# EAGLE design daughtercard (EAGLE 9.6.2)
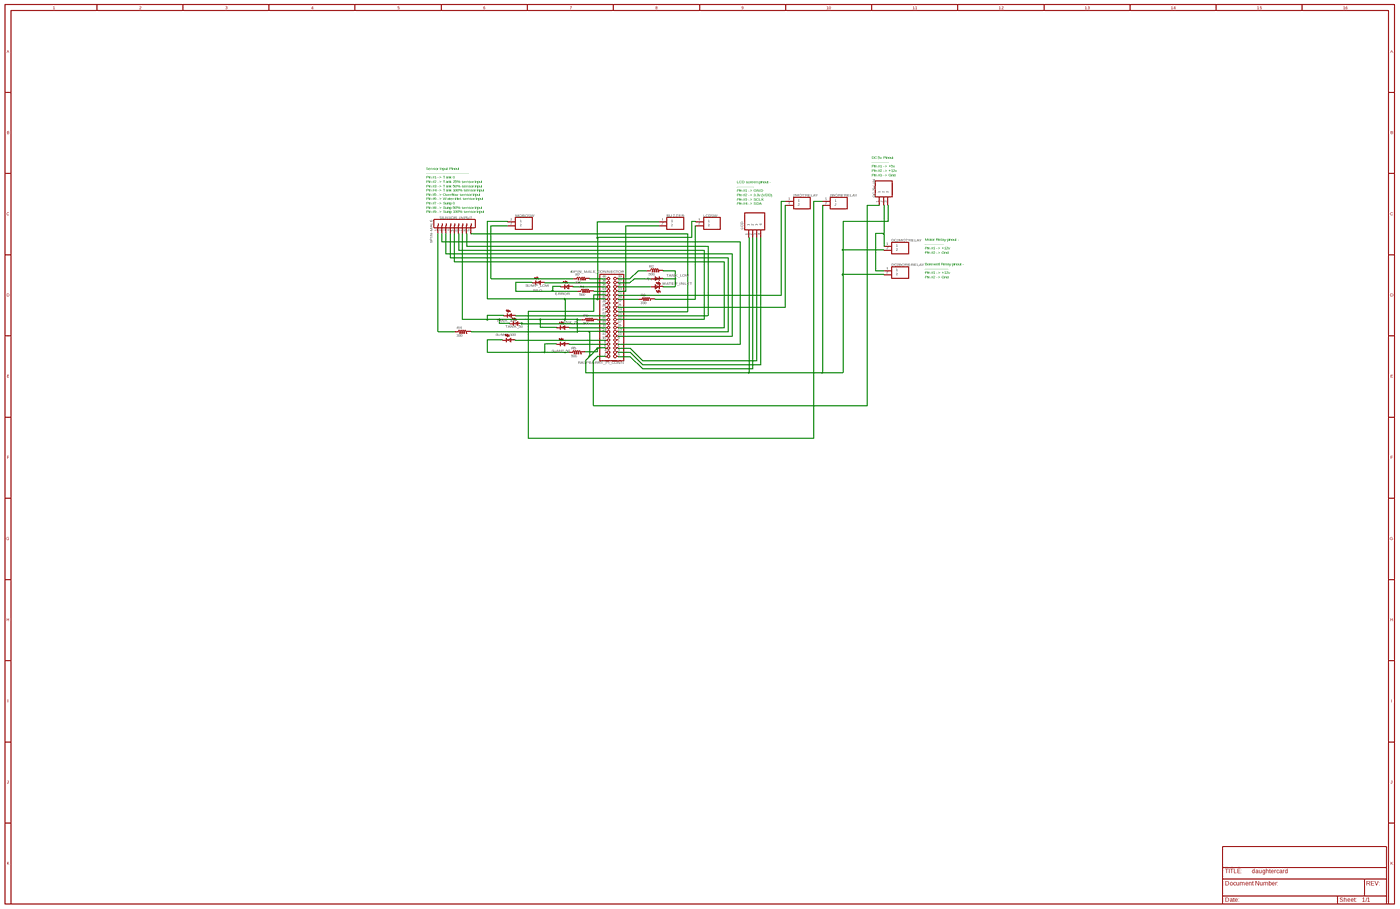
[diagram p0: schematic, sheet 1, overview]
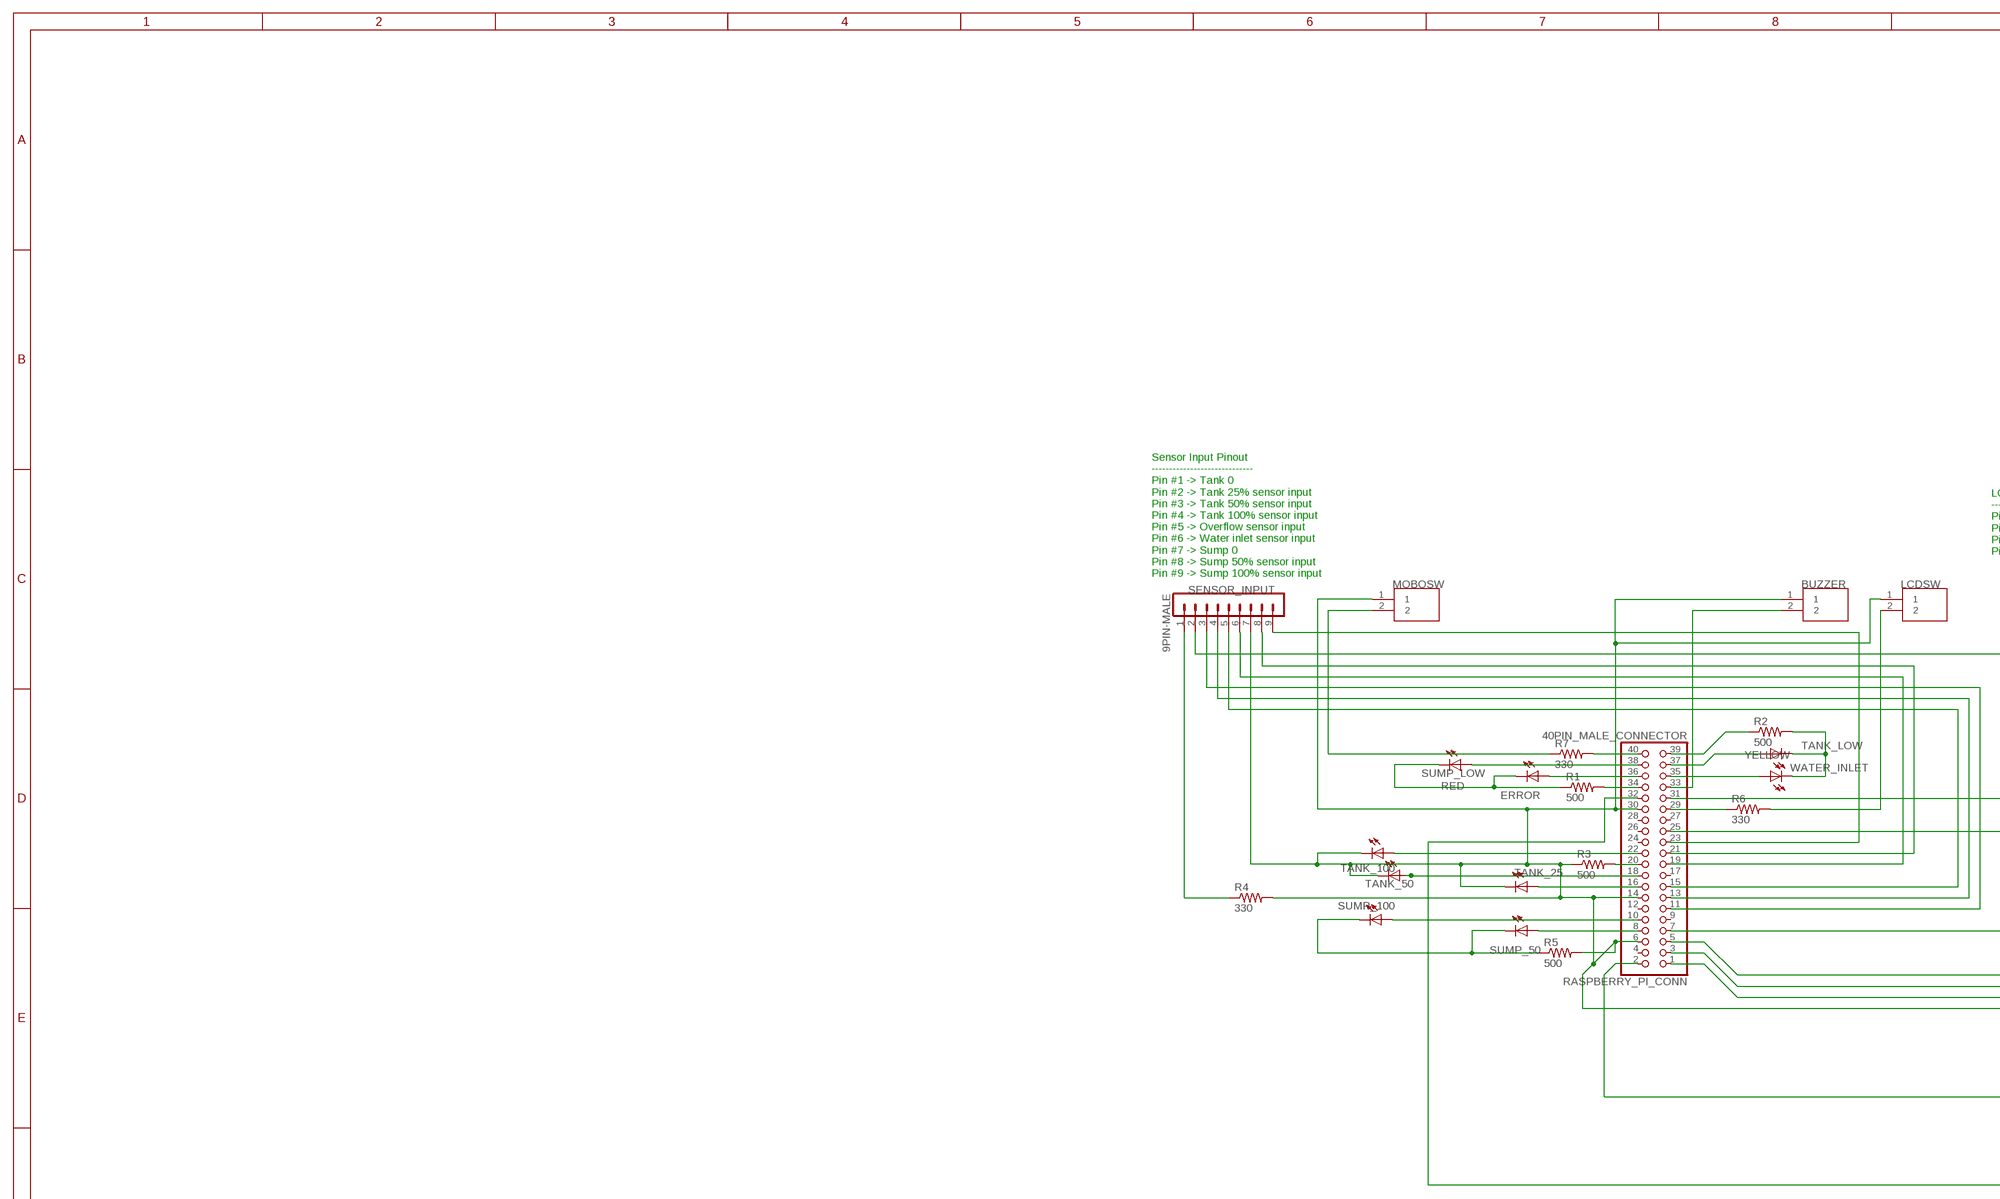
[diagram p1: schematic, sheet 1, part 1 of 4]
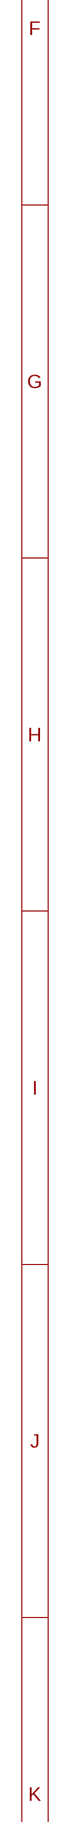
[diagram p2: schematic, sheet 1, part 2 of 4]
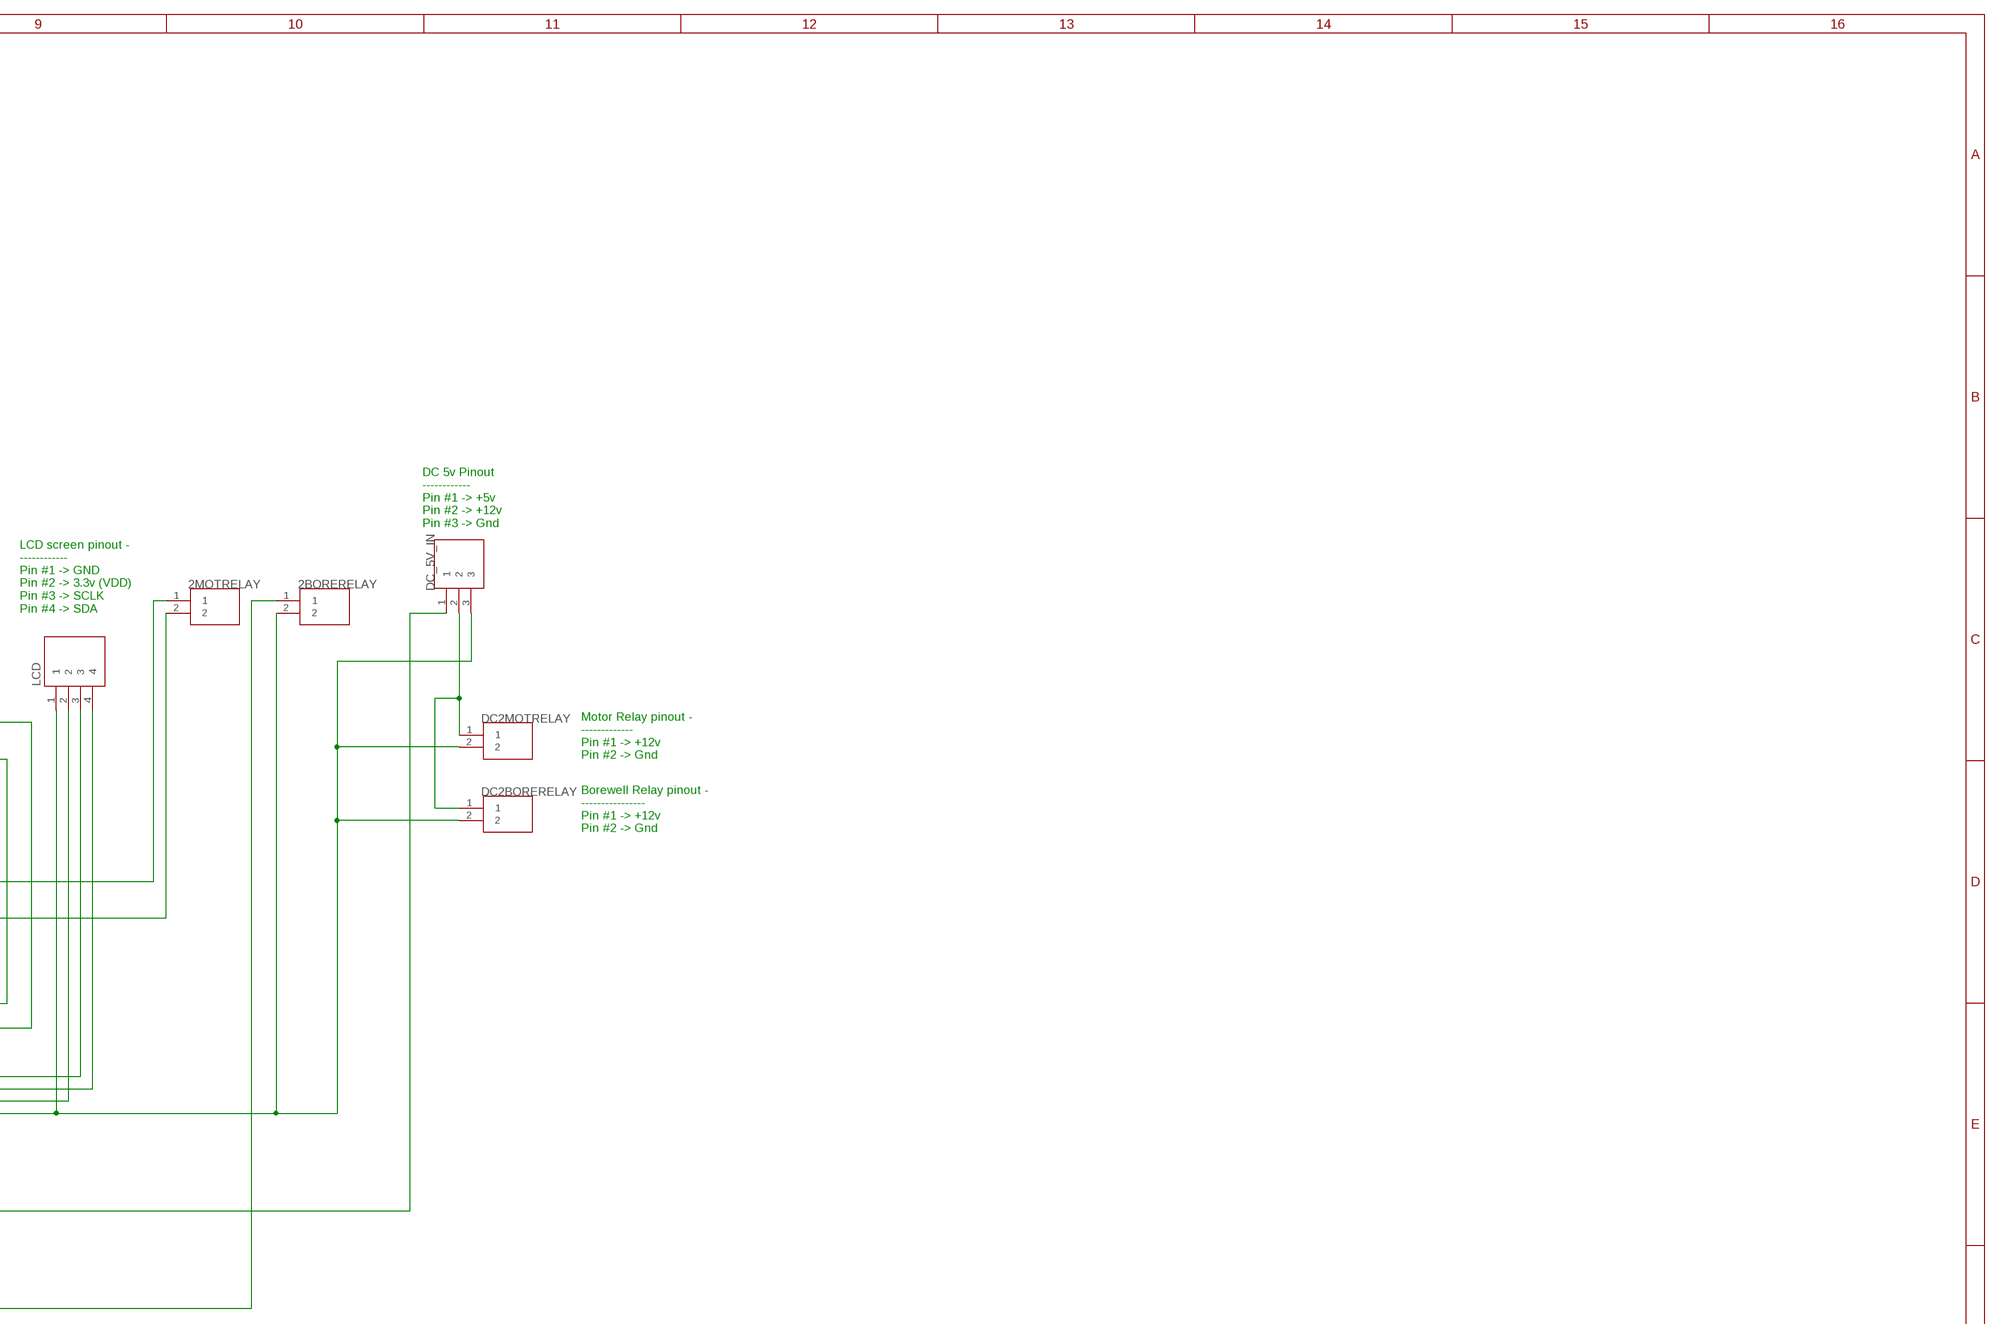
[diagram p3: schematic, sheet 1, part 3 of 4]
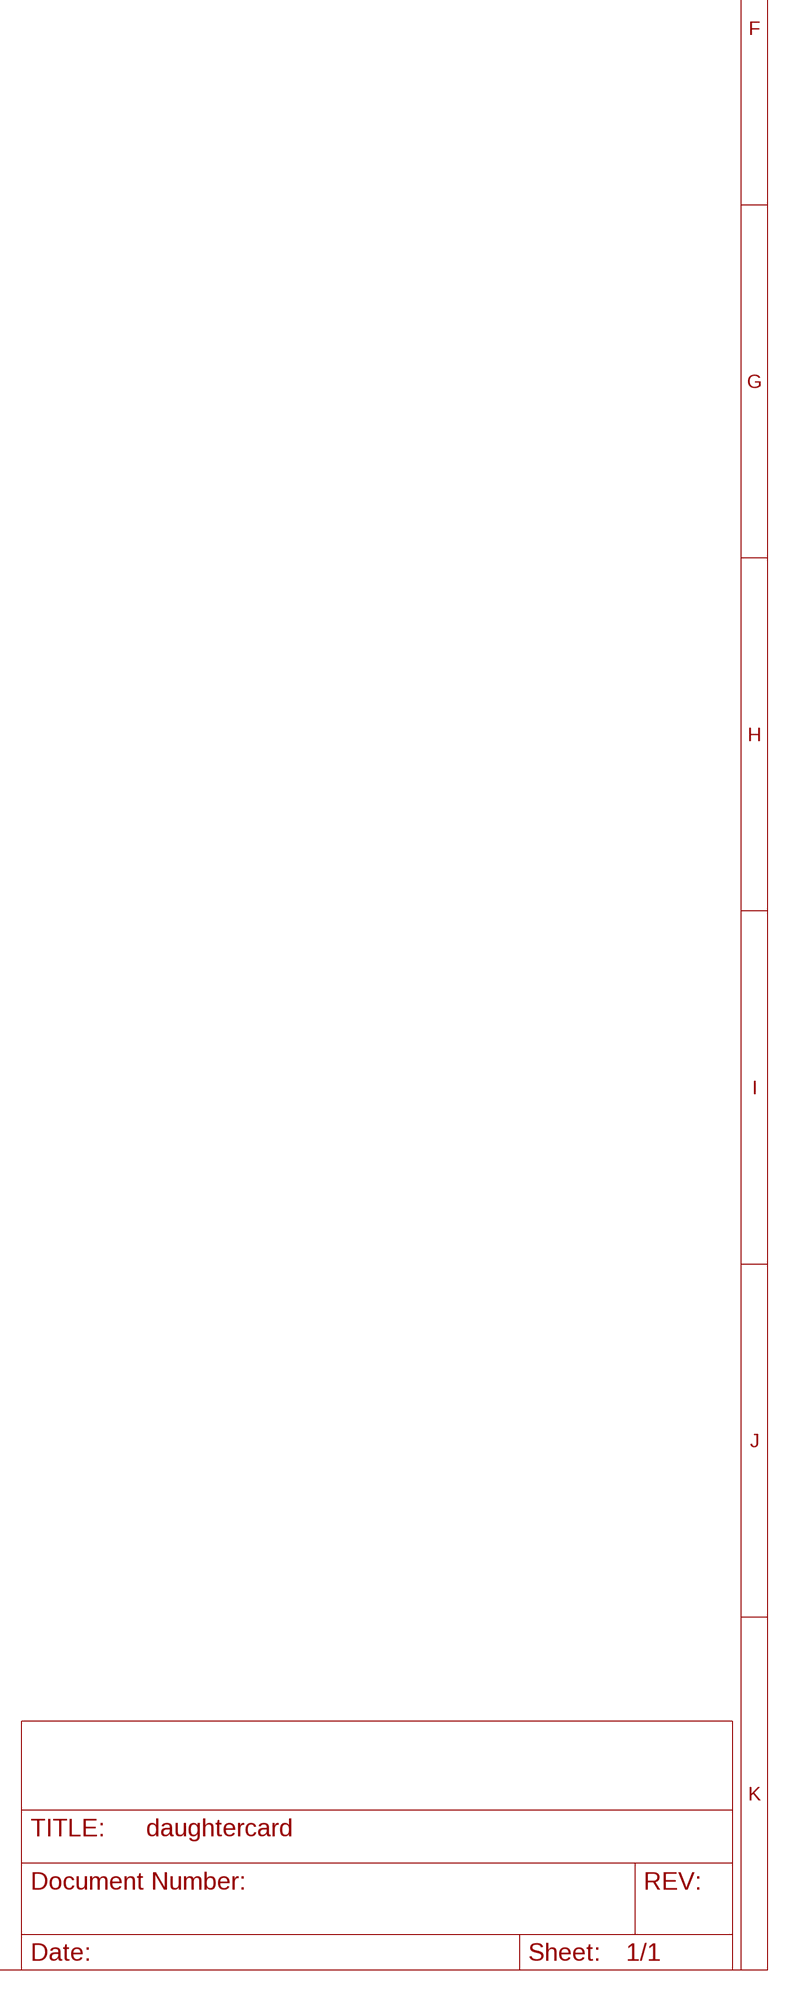
[diagram p4: schematic, sheet 1, part 4 of 4]

## Parts
2BORERELAY  440055-2  [TE_440055-2]
2MOTRELAY  440055-2  [TE_440055-2]
BUZZER  440055-2  [TE_440055-2]
DC2BORERELAY  440055-2  [TE_440055-2]
DC2MOTRELAY  440055-2  [TE_440055-2]
DC_5V_IN  440052-3  [TE_440052-3]
ERROR  RED  LED3MM  [LED3MM]
LCD  110990030  [SEEED_110990030]
LCDSW  440055-2  [TE_440055-2]
MOBOSW  440055-2  [TE_440055-2]
R1  500  R-US_0204/2V  [0204V]
R2  500  R-US_0204/2V  [0204V]
R3  500  R-US_0204/7  [0204/7]
R4  330  R-US_0204/7  [0204/7]
R5  500  R-US_0204/2V  [0204V]
R6  330  R-US_0204/2V  [0204V]
R7  330  R-US_0204/2V  [0204V]
RASPBERRY_PI_CONN  40PIN_MALE_CONNECTOR  PINHD-2X20  [2X20]
SENSOR_INPUT  9PIN-MALE  MA09-1  [MA09-1]
SUMP_50  GREEN  LED3MM  [LED3MM]
SUMP_100  GREEN  LED3MM  [LED3MM]
SUMP_LOW  RED  LED3MM  [LED3MM]
TANK_25  GREEN  LED3MM  [LED3MM]
TANK_50  GREEN  LED3MM  [LED3MM]
TANK_100  GREEN  LED3MM  [LED3MM]
TANK_LOW  RED  LED3MM  [LED3MM]
WATER_INLET  YELLOW  LED3MM  [LED3MM]

## Nets
N$1: RASPBERRY_PI_CONN.19 SENSOR_INPUT.6
N$2: 2MOTRELAY.1 RASPBERRY_PI_CONN.31
N$3: DC2BORERELAY.1 DC2MOTRELAY.1 DC_5V_IN.2
N$4: 2BORERELAY.2 BUZZER.1 DC2BORERELAY.2 DC2MOTRELAY.2 DC_5V_IN.3 LCD.1 LCDSW.1 MOBOSW.1 R3.1 R4.2 R5.2 RASPBERRY_PI_CONN.6 RASPBERRY_PI_CONN.14 RASPBERRY_PI_CONN.30 SENSOR_INPUT.7 TANK_25.K(C) TANK_50.K(C) TANK_100.K(C)
N$5: R1.2 RASPBERRY_PI_CONN.34
N$6: RASPBERRY_PI_CONN.21 SENSOR_INPUT.8
N$7: R3.2 RASPBERRY_PI_CONN.20
N$8: R4.1 SENSOR_INPUT.1
N$9: RASPBERRY_PI_CONN.23 SENSOR_INPUT.9
N$10: 2BORERELAY.1 RASPBERRY_PI_CONN.32
N$11: LCD.4 RASPBERRY_PI_CONN.3
N$12: LCD.3 RASPBERRY_PI_CONN.5
N$13: RASPBERRY_PI_CONN.18 TANK_50.A
N$14: R5.1 SUMP_50.K(C) SUMP_100.K(C)
N$15: R2.1 RASPBERRY_PI_CONN.39
N$16: LCDSW.2 R6.2
N$17: R6.1 RASPBERRY_PI_CONN.29
N$18: R7.2 RASPBERRY_PI_CONN.40
N$19: 2MOTRELAY.2 RASPBERRY_PI_CONN.25
N$20: RASPBERRY_PI_CONN.15 SENSOR_INPUT.5
N$21: ERROR.K(C) R1.1 SUMP_LOW.K(C)
N$22: R2.2 TANK_LOW.K(C) WATER_INLET.K(C)
N$23: ERROR.A RASPBERRY_PI_CONN.36
N$24: RASPBERRY_PI_CONN.38 SUMP_LOW.A
N$25: RASPBERRY_PI_CONN.22 TANK_100.A
N$26: MOBOSW.2 R7.1
N$28: RASPBERRY_PI_CONN.16 TANK_25.A
N$29: RASPBERRY_PI_CONN.10 SUMP_100.A
N$31: RASPBERRY_PI_CONN.37 TANK_LOW.A
N$32: RASPBERRY_PI_CONN.8 SUMP_50.A
N$33: RASPBERRY_PI_CONN.35 WATER_INLET.A
N$35: RASPBERRY_PI_CONN.7 SENSOR_INPUT.2
N$36: RASPBERRY_PI_CONN.11 SENSOR_INPUT.3
N$37: RASPBERRY_PI_CONN.13 SENSOR_INPUT.4
N$44: BUZZER.2 RASPBERRY_PI_CONN.33
VDD: LCD.2 RASPBERRY_PI_CONN.1
VO: DC_5V_IN.1 RASPBERRY_PI_CONN.2
Unconnected: RASPBERRY_PI_CONN.4 RASPBERRY_PI_CONN.9 RASPBERRY_PI_CONN.12 RASPBERRY_PI_CONN.17 RASPBERRY_PI_CONN.24 RASPBERRY_PI_CONN.26 RASPBERRY_PI_CONN.27 RASPBERRY_PI_CONN.28

## Notes on the sheet
- DC 5v Pinout
  ------------
  Pin #1 -> +5v
  Pin #2 -> +12v
  Pin #3 -> Gnd
- LCD screen pinout - 
  ------------
  Pin #1 -> GND
  Pin #2 -> 3.3v (VDD)
  Pin #3 -> SCLK
  Pin #4 -> SDA
- Sensor Input Pinout
  -----------------------------
  Pin #1 -> Tank 0
  Pin #2 -> Tank 25% sensor input
  Pin #3 -> Tank 50% sensor input
  Pin #4 -> Tank 100% sensor input
  Pin #5 -> Overflow sensor input
  Pin #6 -> Water inlet sensor input
  Pin #7 -> Sump 0
  Pin #8 -> Sump 50% sensor input 
  Pin #9 -> Sump 100% sensor input
- Motor Relay pinout -
  -------------
  Pin #1 -> +12v
  Pin #2 -> Gnd
- Borewell Relay pinout -
  ----------------
  Pin #1 -> +12v
  Pin #2 -> Gnd

## Library data of the parts
2BORERELAY 2MOTRELAY BUZZER DC2BORERELAY DC2MOTRELAY LCDSW MOBOSW = 440055-2:440055-2: Check availability <https://pricing.snapeda.com/parts/440055-2/TE%20Connectivity/view-part?ref=eda>; AVAILABILITY: In Stock; CENTERLINE_PITCH: 2 mm[.079 in]; COMMENT: 440055-2; DESCRIPTION: 2.0MM,HDR,2POS,R/A; EU_ROHS_COMPLIANCE: Compliant; MF: TE Connectivity; MP: 440055-2; NUMBER_OF_POSITIONS: 2; PACKAGE: None; PRICE: None; PRODUCT_TYPE: Connector; PURCHASE-URL: https://pricing.snapeda.com/search/part/440055-2/?ref=eda
DC_5V_IN = 440052-3:440052-3: Check availability <https://pricing.snapeda.com/parts/440052-3/TE%20Connectivity/view-part?ref=eda>; AVAILABILITY: In Stock; CENTERLINE_PITCH: 2.5 mm[.098 in]; COMMENT: 440052-3; DESCRIPTION: 2.5MM,HDR,3POS,VERTICAL, CONNECTOR; EU_ROHS_COMPLIANCE: Compliant; MF: TE Connectivity; MP: 440052-3; NUMBER_OF_POSITIONS: 3; PACKAGE: None; PRICE: None; PRODUCT_TYPE: Connector; PURCHASE-URL: https://pricing.snapeda.com/search/part/440052-3/?ref=eda
ERROR SUMP_50 SUMP_100 SUMP_LOW TANK_25 TANK_50 TANK_100 TANK_LOW WATER_INLET = led:LED: LED OSRAM: - CHIPLED LG R971, LG N971, LY N971, LG Q971, LY Q971, LO R971, LY R971 LH N974, LH R974 LS Q976, LO Q976, LY Q976 LO Q996 - Hyper CHIPLED LW Q18S LB Q993, LB Q99A, LB R99A - SideLED LS A670, LO A670, LY A670, LG A670, LP A670 LB A673, LV A673, LT A673, LW A673 LH A674 LY A675 LS A676, LA A676, LO A676, LY A676, LW A676 LS A679, LY A679, LG A679 - Hyper Micro SIDELED® LS Y876, LA Y876, LO Y876, LY Y876 LT Y87S - SmartLED LW L88C, LW L88S LB L89C, LB L89S, LG L890 LS L89K, LO L89K, LY L89K LS L896, LA L896, LO L896, LY L896 - TOPLED LS T670, LO T670, LY T670, LG T670, LP T670 LSG T670, LSP T670, LSY T670, LOP T670, LYG T670 LG T671, LOG T671, LSG T671 LB T673, LV T673, LT T673, LW T673 LH T674 LS T676, LA T676, LO T676, LY T676, LB T676, LH T676, LSB T676, LW T676 LB T67C, LV T67C, LT T67C, LS T67K, LO T67K, LY T67K, LW E67C LS E67B, LA E67B, LO E67B, LY E67B, LB E67C, LV E67C, LT E67C LW T67C LS T679, LY T679, LG T679 LS T770, LO T770, LY T770, LG T770, LP T770 LB T773, LV T773, LT T773, LW T773 LH T774 LS E675, LA E675, LY E675, LS T675 LS T776, LA T776, LO T776, LY T776, LB T776 LHGB T686 LT T68C, LB T68C - Hyper Mini TOPLED® LB M676 - Mini TOPLED Santana® LG M470 LS M47K, LO M47K, LY M47K Source: http://www.osram.convergy.de LUXEON: - LUMILED® LXK2-PW12-R00, LXK2-PW12-S00, LXK2-PW14-U00, LXK2-PW14-V00 LXK2-PM12-R00, LXK2-PM12-S00, LXK2-PM14-U00 LXK2-PE12-Q00, LXK2-PE12-R00, LXK2-PE12-S00, LXK2-PE14-T00, LXK2-PE14-U00 LXK2-PB12-K00, LXK2-PB12-L00, LXK2-PB12-M00, LXK2-PB14-N00, LXK2-PB14-P00, LXK2-PB14-Q00 LXK2-PR12-L00, LXK2-PR12-M00, LXK2-PR14-Q00, LXK2-PR14-R00 LXK2-PD12-Q00, LXK2-PD12-R00, LXK2-PD12-S00 LXK2-PH12-R00, LXK2-PH12-S00 LXK2-PL12-P00, LXK2-PL12-Q00, LXK2-PL12-R00 Source: www.luxeon.com KINGBRIGHT: KA-3528ASYC Source: www.kingbright.com
LCD = 110990030:110990030: Check availability <https://pricing.snapeda.com/parts/110990030/Seeed%20Technology%20Co.%2C%20Ltd/view-part?ref=eda>; AVAILABILITY: In Stock; DESCRIPTION: GROVE 2MM 4PIN VERT CONN 10PCS; MF: Seeed Technology Co., Ltd; MP: 110990030; PACKAGE: None; PRICE: None; PURCHASE-URL: https://pricing.snapeda.com/search/part/110990030/?ref=eda
R1-R7 = rcl:R-US_: RESISTOR, American symbol; SPICEPREFIX: R
RASPBERRY_PI_CONN = pinhead:PINHD-2X20: PIN HEADER
SENSOR_INPUT = con-lstb:MA09-1: PIN HEADER; OC_FARNELL: unknown; OC_NEWARK: unknown

## Net classes
0 default: width 0.813 mm
1 AC_VOLTAGE: width 1.626 mm

## Board
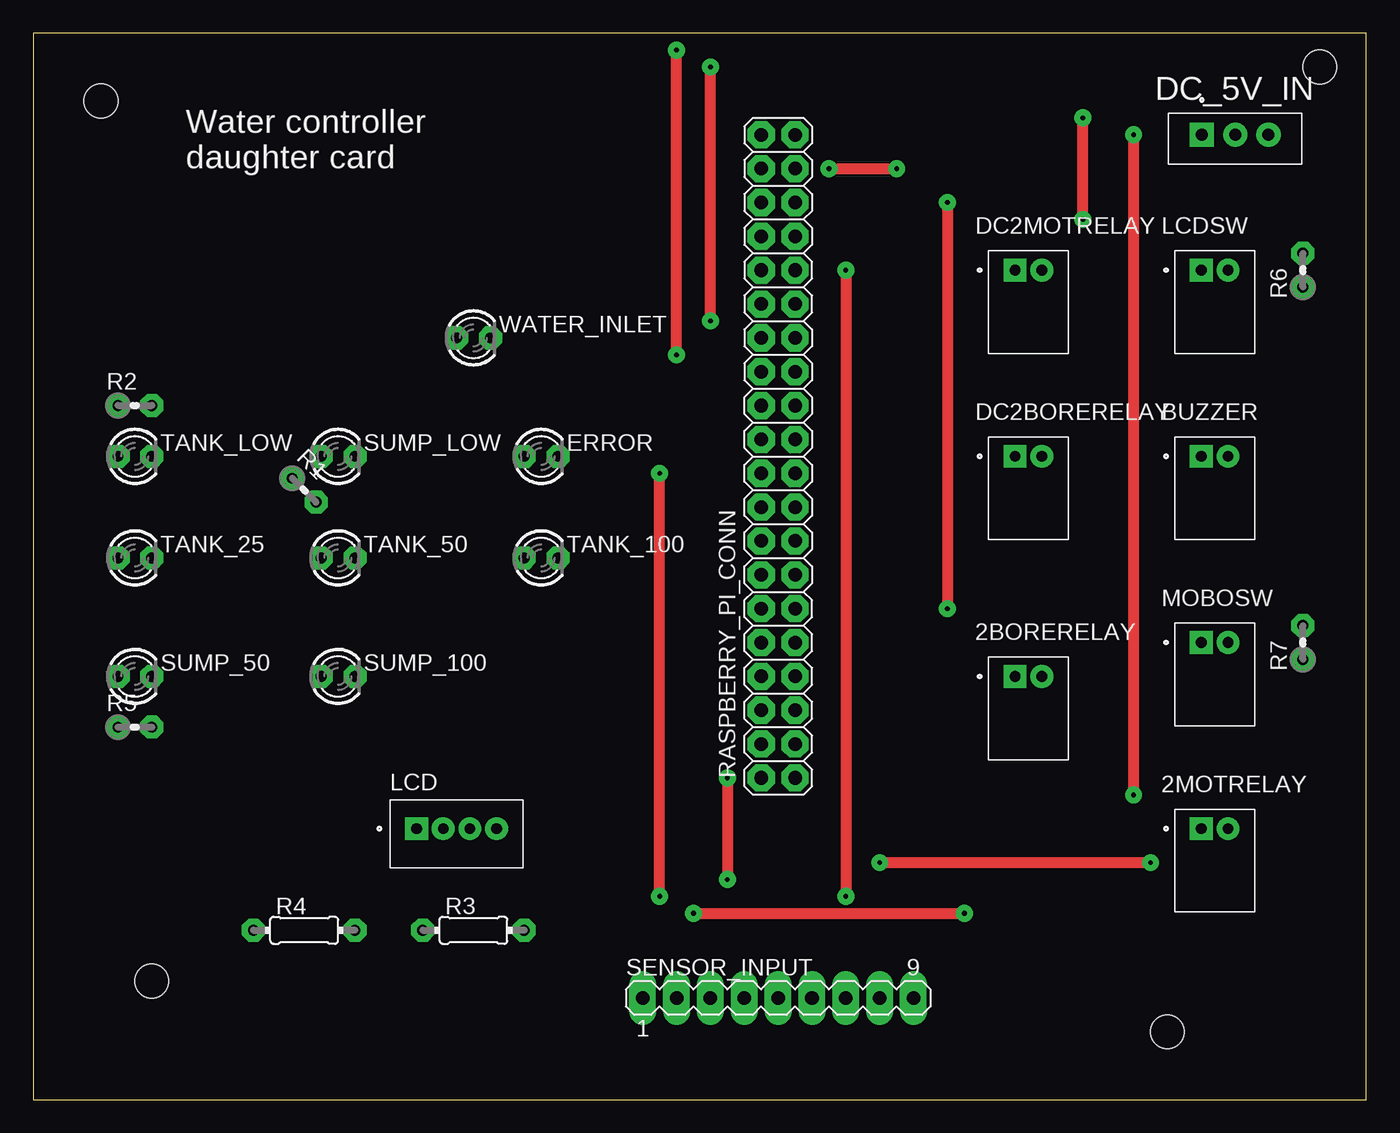
[diagram p5: board, top side]
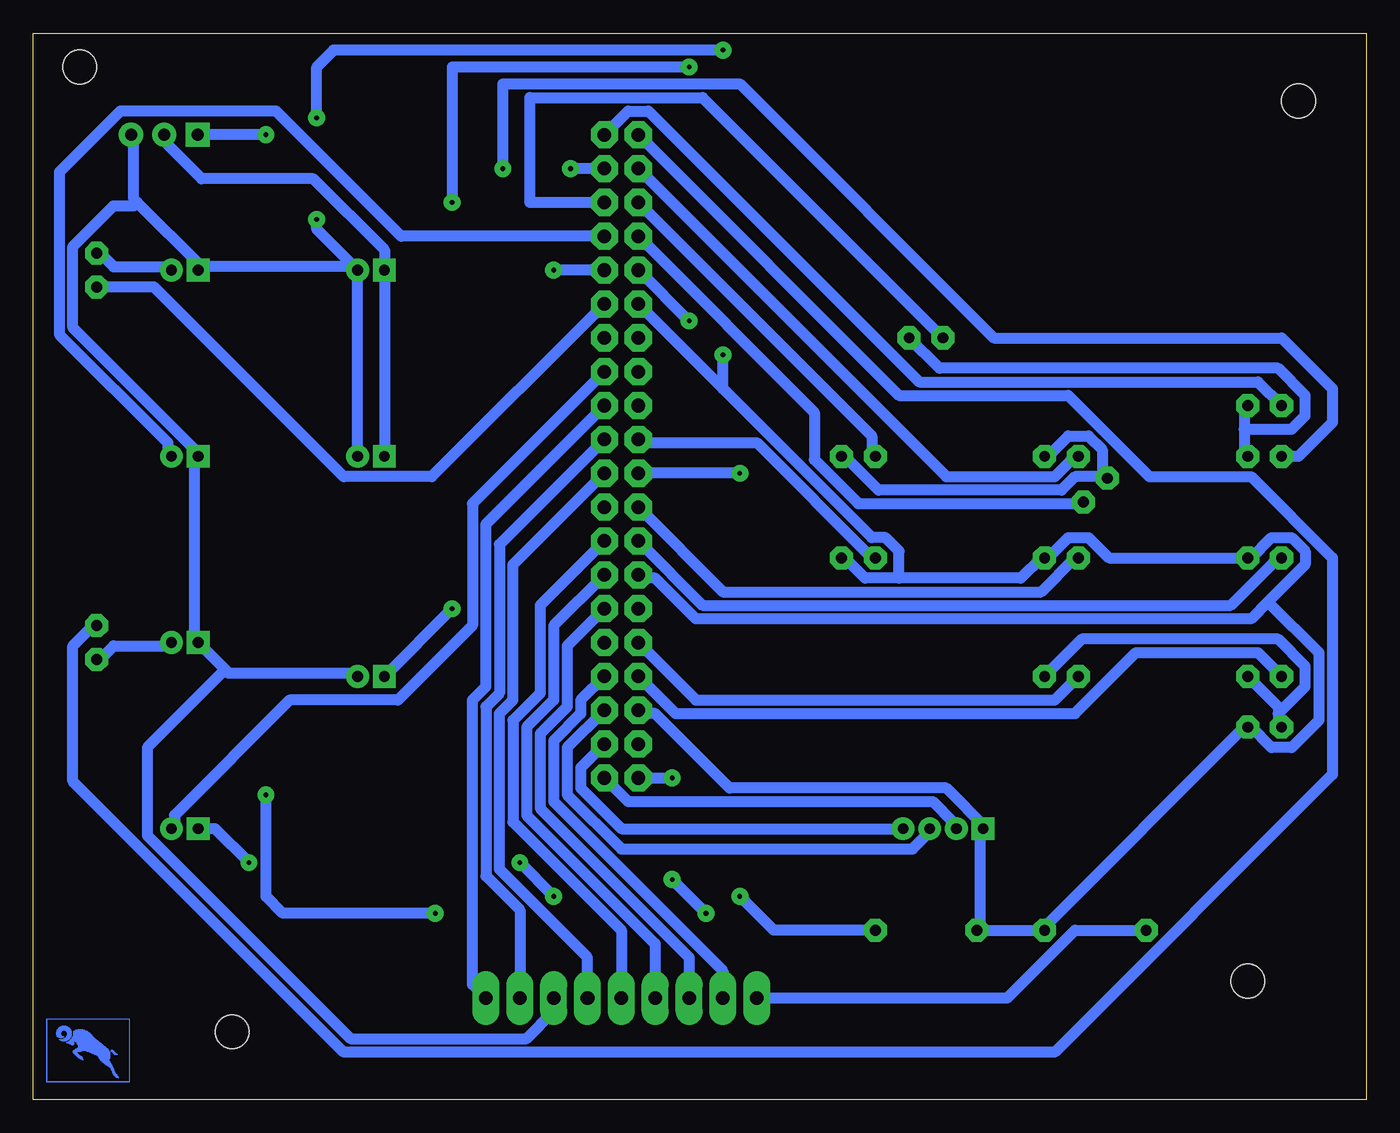
[diagram p6: board, bottom side, seen from below]

Size 100 x 80 mm. Coordinates in mm from the lower left corner, seen from the top.
Outline: 0,0 100,0 100,80 0,80 0,0
Copper layers (1*16): Top 0.035mm / dielectric 1.5mm / Bottom 0.035mm
Design rules "PCB_at_home": minimum track width 32mil, minimum drill 10mil, track to track 8mil, track to pad 8mil, pad to pad 8mil, via to via 8mil, smd to smd 8mil, copper to edge 8mil, drill to drill 8mil, minimum pad ring 18mil, minimum via ring 18mil, stop-mask expansion 2mil, vias tented up to drill 20mil, thermal gap 10mil
Holes 2.54 mm at 5.08,74.93 8.89,8.89 85.09,5.08 96.52,77.47

### Footprints (pad centres in the part's own frame; a part is rotated, then mirrored left to right if it is on the bottom)
TE_440055-2 = drill 0.8 pad 1.15 square: 1 0,0 | drill 0.8 pad 1.15: 2 2.007,0
TE_440052-3 = drill 0.9 square: 1 -2.5,0 | drill 0.9: 2 0,0; 3 2.5,0
LED3MM = drill 0.813 octagon: A -1.27,0; K 1.27,0
SEEED_110990030 = drill 0.8 square: 1 -3,0 | drill 0.8: 2 -1,0; 3 1,0; 4 3,0
0204V = drill 0.813 octagon: 1 -1.27,0; 2 1.27,0
0204/7 = drill 0.813 octagon: 1 -3.81,0; 2 3.81,0
2X20 = drill 1.016 octagon: 1 -24.13,-1.27; 2 -24.13,1.27; 3 -21.59,-1.27; 4 -21.59,1.27; 5 -19.05,-1.27; 6 -19.05,1.27; 7 -16.51,-1.27; 8 -16.51,1.27; 9 -13.97,-1.27; 10 -13.97,1.27; 11 -11.43,-1.27; 12 -11.43,1.27; 13 -8.89,-1.27; 14 -8.89,1.27; 15 -6.35,-1.27; 16 -6.35,1.27; 17 -3.81,-1.27; 18 -3.81,1.27; 19 -1.27,-1.27; 20 -1.27,1.27; 21 1.27,-1.27; 22 1.27,1.27; 23 3.81,-1.27; 24 3.81,1.27; 25 6.35,-1.27; 26 6.35,1.27; 27 8.89,-1.27; 28 8.89,1.27; 29 11.43,-1.27; 30 11.43,1.27; 31 13.97,-1.27; 32 13.97,1.27; 33 16.51,-1.27; 34 16.51,1.27; 35 19.05,-1.27; 36 19.05,1.27; 37 21.59,-1.27; 38 21.59,1.27; 39 24.13,-1.27; 40 24.13,1.27
MA09-1 = drill 1.016 long: 1 -10.16,0; 2 -7.62,0; 3 -5.08,0; 4 -2.54,0; 5 0,0; 6 2.54,0; 7 5.08,0; 8 7.62,0; 9 10.16,0

### Placement (x,y rotation side)
2BORERELAY  73.66,31.75 0 top
2MOTRELAY  87.63,20.32 0 top
BUZZER  87.63,48.26 0 top
DC2BORERELAY  73.66,48.26 0 top
DC2MOTRELAY  73.66,62.23 0 top
DC_5V_IN  90.17,72.39 0 top
ERROR  38.1,48.26 0 top
LCD  31.75,20.32 0 top
LCDSW  87.63,62.23 0 top
MOBOSW  87.63,34.29 0 top
R1  20.32,45.72 315 top
R2  7.62,52.07 0 top
R3  33.02,12.7 0 top
R4  20.32,12.7 0 top
R5  7.62,27.94 0 top
R6  95.25,62.23 90 top
R7  95.25,34.29 90 top
RASPBERRY_PI_CONN  55.88,48.26 90 top
SENSOR_INPUT  55.88,7.62 0 top
SUMP_50  7.62,31.75 0 top
SUMP_100  22.86,31.75 0 top
SUMP_LOW  22.86,48.26 0 top
TANK_25  7.62,40.64 0 top
TANK_50  22.86,40.64 0 top
TANK_100  38.1,40.64 0 top
TANK_LOW  7.62,48.26 0 top
WATER_INLET  33.02,57.15 0 top

### Tracks (layer width: path | path; a pad name or v marks a point on that pad's centre or on a via)
N$1
  Bottom 0.813: RASPBERRY_PI_CONN.19 64.01,40.13 64.01,29.97 65.02,28.96 65.02,17.27 58.42,10.67 SENSOR_INPUT.6
N$2  (via drill 0.35)
  Top 0.813: v63.5,17.78 v83.82,17.78 | v60.96,62.23 v60.96,15.24
  Bottom 0.813: v60.96,15.24 v63.5,17.78 | v83.82,17.78 86.36,20.32 2MOTRELAY.1 | RASPBERRY_PI_CONN.31 v60.96,62.23
N$3
  Bottom 0.813: DC2BORERELAY.1 DC2MOTRELAY.1 73.66,63.75 78.99,69.09 87.38,69.09 89.92,71.63 89.92,72.14 DC_5V_IN.2
N$4  (via drill 0.35)
  Top 0.813: v78.74,66.04 v78.74,73.66 | v48.26,55.88 v48.26,78.74
  Bottom 0.813: 24.38,12.7 9.14,27.94 R5.2 8.64,27.94 7.11,26.42 5.59,26.42 3.56,28.45 3.56,33.53 7.37,37.34 | 28.96,12.7 28.96,20.32 LCD.1 28.45,20.32 31.5,23.37 47.75,23.37 53.34,28.96 54.36,28.96 RASPBERRY_PI_CONN.6 | 28.96,12.7 24.38,12.7 | 24.38,12.7 R4.2 | 28.96,12.7 R3.1 | 35.05,39.12 25.91,39.12 24.38,40.64 TANK_50.K 23.88,40.64 22.35,42.16 20.83,42.16 19.3,40.64 TANK_25.K 8.64,40.64 7.11,42.16 5.59,42.16 4.57,41.15 4.57,40.13 7.37,37.34 | 35.05,39.12 37.59,39.12 39.12,40.64 TANK_100.K | 7.37,37.34 8.64,36.07 50.29,36.07 53.34,39.12 54.36,39.12 RASPBERRY_PI_CONN.14 | 48.26,53.34 37.08,42.16 36.07,42.16 35.05,41.15 35.05,39.12 | 48.26,53.34 RASPBERRY_PI_CONN.30 | DC2BORERELAY.2 75.69,48.26 75.69,62.2 DC2MOTRELAY.2 | 87.38,62.48 75.69,62.48 DC2MOTRELAY.2 | 87.38,62.48 92.2,67.31 | 92.2,67.31 92.46,67.56 92.46,72.14 DC_5V_IN.3 | 87.38,62.48 LCDSW.1 | 85.6,32.26 MOBOSW.1 87.88,34.54 87.88,48.26 BUZZER.1 87.38,48.26 97.03,57.91 97.03,64.01 93.98,67.06 92.46,67.06 92.2,67.31 | 85.6,32.26 85.34,32 75.69,32 2BORERELAY.2 | SENSOR_INPUT.7 60.96,6.6 62.99,4.57 76.2,4.57 91.44,19.81 91.44,26.42 85.6,32.26 | DC2MOTRELAY.2 78.74,65.3 v78.74,66.04 | v78.74,73.66 78.74,77.47 77.47,78.74 v48.26,78.74 | 48.26,53.34 v48.26,55.88
N$5
  Bottom 0.813: RASPBERRY_PI_CONN.34 41.4,51.56 41.4,48.01 38.1,44.7 21.34,44.7 R1.2
N$6
  Bottom 0.813: SENSOR_INPUT.8 63.5,14.22 66.04,16.76 66.04,29.46 65.02,30.48 65.02,41.66 RASPBERRY_PI_CONN.21
N$7  (via drill 0.35)
  Top 0.813: v46.99,15.24 v46.99,46.99
  Bottom 0.813: R3.2 44.45,12.7 v46.99,15.24 | v46.99,46.99 RASPBERRY_PI_CONN.20
N$8
  Bottom 0.813: R4.1 21.84,12.7 26.92,7.62 SENSOR_INPUT.1
N$9
  Bottom 0.813: RASPBERRY_PI_CONN.23 66.04,43.18 66.04,30.99 67.06,29.97 67.06,8.64 SENSOR_INPUT.9
N$10  (via drill 0.35)
  Top 0.813: v50.8,58.42 v50.8,77.47 | v68.58,67.31 v68.58,36.83
  Bottom 0.813: RASPBERRY_PI_CONN.32 v50.8,58.42 | v68.58,67.31 68.58,74.93 68.58,76.2 68.58,77.47 v50.8,77.47 | 2BORERELAY.1 v68.58,36.83
N$11
  Bottom 0.813: LCD.4 55.88,20.32 58.93,23.37 58.93,24.89 RASPBERRY_PI_CONN.3
N$12
  Bottom 0.813: RASPBERRY_PI_CONN.5 59.94,26.42 59.94,22.86 55.88,18.8 34.04,18.8 33.02,19.81 33.02,20.32 LCD.3
N$13
  Bottom 0.813: RASPBERRY_PI_CONN.18 48.26,38.1 24.38,38.1 21.84,40.64 TANK_50.A
N$14
  Bottom 0.813: 6.6,28.96 6.6,29.46 SUMP_50.K | 6.6,28.96 6.6,27.94 R5.1 | SUMP_100.K 21.34,34.54 6.6,34.54 4.57,32.51 4.57,30.99 6.6,28.96
N$15
  Bottom 0.813: R2.1 8.13,53.85 33.53,53.85 53.85,74.17 55.37,74.17 RASPBERRY_PI_CONN.39
N$16
  Bottom 0.813: LCDSW.2 89.92,62.48 93.98,62.48 95,63.5 R6.2
N$17
  Bottom 0.813: R6.1 90.93,60.96 76.71,46.74 70.1,46.74 RASPBERRY_PI_CONN.29
N$18
  Bottom 0.813: RASPBERRY_PI_CONN.40 35.05,52.83 22.35,52.83 16.26,46.74 8.64,46.74 2.54,40.64 2.54,24.38 23.37,3.56 76.71,3.56 97.03,23.88 97.03,34.04 95.5,35.56 R7.2
N$19
  Bottom 0.813: RASPBERRY_PI_CONN.25 67.06,44.7 67.06,35.56 72.64,29.97 80.77,29.97 89.41,21.34 89.41,20.32 2MOTRELAY.2
N$20
  Bottom 0.813: SENSOR_INPUT.5 55.88,12.7 64.01,20.83 64.01,28.45 61.98,30.48 61.98,37.08 RASPBERRY_PI_CONN.15
N$21
  Bottom 0.813: 19.81,46.74 19.81,48.77 20.83,49.78 22.35,49.78 23.88,48.26 SUMP_LOW.K | 19.81,46.74 21.84,46.74 22.86,45.72 36.58,45.72 39.12,48.26 ERROR.K | 19.81,46.74 R1.1
N$22
  Bottom 0.813: 9.14,50.29 9.14,51.82 R2.2 | 9.14,50.29 9.14,48.26 TANK_LOW.K | WATER_INLET.K 32,54.86 6.6,54.86 4.57,52.83 4.57,51.31 5.59,50.29 9.14,50.29
N$23
  Bottom 0.813: RASPBERRY_PI_CONN.36 37.08,49.78 37.08,48.26 ERROR.A
N$24
  Bottom 0.813: RASPBERRY_PI_CONN.38 31.5,46.74 23.37,46.74 21.84,48.26 SUMP_LOW.A
N$25
  Bottom 0.813: TANK_100.A 37.08,40.64 45.72,49.28 54.36,49.28 RASPBERRY_PI_CONN.22
N$26
  Bottom 0.813: MOBOSW.2 89.92,34.04 93.98,34.04 95,33.02 R7.1
N$28
  Bottom 0.813: RASPBERRY_PI_CONN.16 49.78,37.08 10.16,37.08 6.6,40.64 TANK_25.A
N$29
  Bottom 0.813: SUMP_100.A 23.37,29.97 50.29,29.97 RASPBERRY_PI_CONN.10
N$31  (via drill 0.35)
  Top 0.813: v59.69,69.85 v64.77,69.85
  Bottom 0.813: RASPBERRY_PI_CONN.37 v59.69,69.85 | TANK_LOW.A 5.08,48.26 2.54,50.8 2.54,53.34 6.35,57.15 27.94,57.15 46.99,76.2 64.77,76.2 v64.77,69.85
N$32
  Bottom 0.813: SUMP_50.A 8.13,33.53 17.27,33.53 21.84,28.96 51.82,28.96 RASPBERRY_PI_CONN.8
N$33
  Bottom 0.813: WATER_INLET.A 49.78,75.18 62.74,75.18 62.74,67.31 RASPBERRY_PI_CONN.35
N$35
  Bottom 0.813: SENSOR_INPUT.2 48.26,9.65 60.96,22.35 60.96,26.92 58.93,28.96 58.93,29.97 RASPBERRY_PI_CONN.7
N$36
  Bottom 0.813: SENSOR_INPUT.3 50.8,10.67 61.98,21.84 61.98,27.43 59.94,29.46 59.94,34.04 RASPBERRY_PI_CONN.11
N$37
  Bottom 0.813: SENSOR_INPUT.4 53.34,11.68 62.99,21.34 62.99,27.94 60.96,29.97 60.96,35.56 RASPBERRY_PI_CONN.13
N$44
  Bottom 0.813: RASPBERRY_PI_CONN.33 72.39,64.77 81.79,74.17 93.47,74.17 98.04,69.6 98.04,57.4 89.92,49.28 89.92,48.26 BUZZER.2
VDD
  Bottom 0.813: RASPBERRY_PI_CONN.1 55.37,22.35 32.51,22.35 30.99,20.83 30.99,20.32 LCD.2
VO  (via drill 0.35)
  Top 0.813: v52.07,24.13 v52.07,16.51 | v49.53,13.97 v69.85,13.97 | v82.55,22.86 v82.55,72.39
  Bottom 0.813: RASPBERRY_PI_CONN.2 v52.07,24.13 | v52.07,16.51 v49.53,13.97 | v69.85,13.97 81.28,13.97 82.55,15.24 v82.55,22.86 | v82.55,72.39 DC_5V_IN.1
(copper drawn outside any net)
  shapes: Bottom area x640

### Text on the board
tPlace: Water controller / daughter card